# EAGLE design power (EAGLE 6.3)
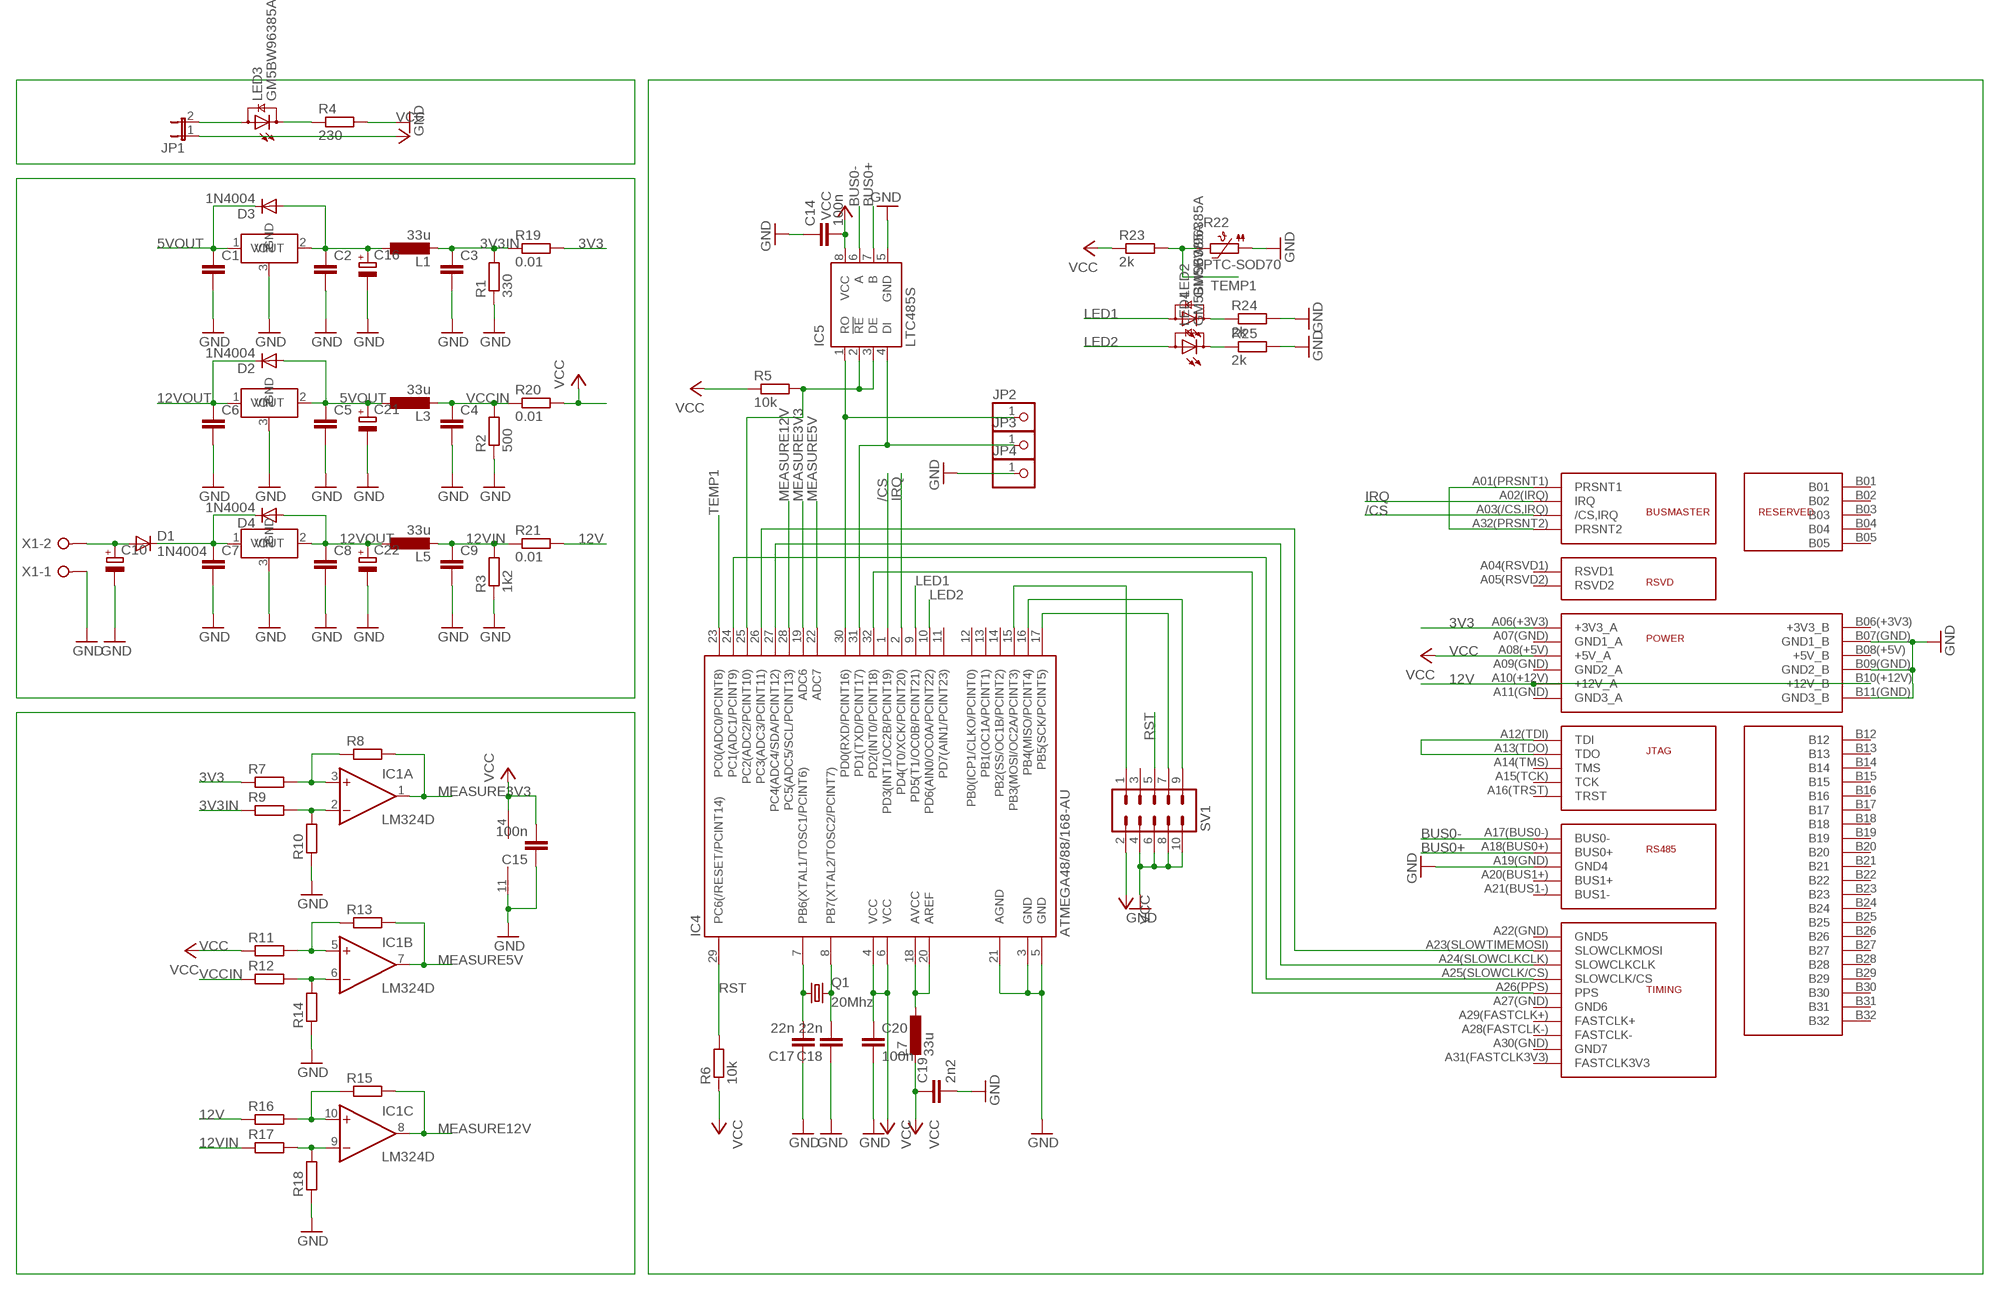
[diagram p0: schematic, sheet 1]

## Parts
C1  C-EUC0805  [C0805]
C2  C-EUC0805  [C0805]
C3  C-EUC0805  [C0805]
C4  C-EUC0805  [C0805]
C5  C-EUC0805  [C0805]
C6  C-EUC0805  [C0805]
C7  C-EUC0805  [C0805]
C8  C-EUC0805  [C0805]
C9  C-EUC0805  [C0805]
C10  CPOL-EU150CLZ-1010  [150CLZ-1010]
C14  100n  C-EUC0603  [C0603]
C15  100n  C-EUC0603  [C0603]
C16  CPOL-EU153CLV-0505  [153CLV-0505]
C17  22n  C-EUC0603  [C0603]
C18  22n  C-EUC0603  [C0603]
C19  2n2  C-EUC0603  [C0603]
C20  100n  C-EUC0603  [C0603]
C21  CPOL-EU153CLV-0505  [153CLV-0505]
C22  CPOL-EU153CLV-0505  [153CLV-0505]
D1  1N4004  [DO41-10]
D2  1N4004  [DO41-10]
D3  1N4004  [DO41-10]
D4  1N4004  [DO41-10]
IC1  LM324D  [SO14]
IC4  ATMEGA48/88/168-AU  [TQFP32-08]
IC5  LTC485S  [SOIC8]
JP1  JP1E  [JP1]
JP2  PINHD-1X1  [1X01]
JP3  PINHD-1X1  [1X01]
JP4  PINHD-1X1  [1X01]
L1  33u  L-EU0207/5V  [0207/5V]
L3  33u  L-EU0207/5V  [0207/5V]
L5  33u  L-EU0207/5V  [0207/5V]
L7  33u  L-EU0207/5V  [0207/5V]
LED2  GM5BW96385A  [GM5BW96385A]
LED3  GM5BW96385A  [GM5BW96385A]
LED4  GM5BW96385A  [GM5BW96385A]
Q1  20Mhz  CRYSTALHC49UP  [HC49UP]
R1  330  R-EU_R0805  [R0805]
R2  500  R-EU_R0603  [R0603]
R3  1k2  R-EU_R0603  [R0603]
R4  230  R-EU_R0603  [R0603]
R5  10k  R-EU_R0603  [R0603]
R6  10k  R-EU_R0603  [R0603]
R7  R-EU_R0603  [R0603]
R8  R-EU_R0603  [R0603]
R9  R-EU_R0603  [R0603]
R10  R-EU_R0603  [R0603]
R11  R-EU_R0603  [R0603]
R12  R-EU_R0603  [R0603]
R13  R-EU_R0603  [R0603]
R14  R-EU_R0603  [R0603]
R15  R-EU_R0603  [R0603]
R16  R-EU_R0603  [R0603]
R17  R-EU_R0603  [R0603]
R18  R-EU_R0603  [R0603]
R19  0.01  R-EU_0207/15  [0207/15]
R20  0.01  R-EU_0207/15  [0207/15]
R21  0.01  R-EU_0207/15  [0207/15]
R22  PTC-SOD70  [SOD70]
R23  2k  R-EU_R0603  [R0603]
R24  2k  R-EU_R0603  [R0603]
R25  2k  R-EU_R0603  [R0603]
SV1  MA05-2  [MA05-2]
U$1  FRIENDSHIPCONNECTOR  [FRIENDSHIP_EDGE_CONNECTOR]
U$2  AP1084  [TO263]
U$3  AP1084  [TO263]
U$4  AP1084  [TO263]
X1  W237-02P  [W237-132]

## Nets
3V3: R7.1 R19.2 U$1.A06(+3V3)(+3V3_A)
3V3IN: C3.1 L1.2 R1.2 R9.1 R19.1
5VOUT: C1.1 C5.1 C21.+ D2.A D3.C L3.1 U$2.1(VIN) U$3.2(VOUT)
12V: R16.1 R21.2 U$1.A10(+12V)(+12V_A) U$1.B10(+12V)(+12V_B)
12VIN: C9.1 L5.2 R3.2 R17.1 R21.1
12VOUT: C6.1 C8.1 C22.+ D2.C D4.A L5.1 U$3.1(VIN) U$4.2(VOUT)
/CS: IC4.1(PD3(INT1/OC2B/PCINT19)) U$1.A03(/CS,IRQ)(/CS,IRQ)
BUS0+: IC5.7(B) U$1.A18(BUS0+)(BUS0+)
BUS0-: IC5.6(A) U$1.A17(BUS0-)(BUS0-)
GND: C1.2 C2.2 C3.2 C4.2 C5.2 C6.2 C7.2 C8.2 C9.2 C10.- C14.1 C15.1 C16.- C17.1 C18.1 C19.2 C20.2 C21.- C22.- IC1.11(P:V-) IC4.3(GND) IC4.5(GND) IC4.21(AGND) IC5.5(GND) JP4.1 R1.1 R2.1 R3.1 R4.2 R10.1 R14.1 R18.1 R22.1 R24.2 R25.2 SV1.4 SV1.6 SV1.8 SV1.10 U$1.A19(GND)(GND4) U$1.B07(GND)(GND1_B) U$1.B09(GND)(GND2_B) U$1.B11(GND)(GND3_B) U$2.3(GND) U$3.3(GND) U$4.3(GND) X1.1
IRQ: IC4.2(PD4(T0/XCK/PCINT20)) U$1.A02(IRQ)(IRQ)
LED1: IC4.9(PD5(T1/OC0B/PCINT21)) LED2.A
LED2: IC4.10(PD6(AIN0/OC0A/PCINT22)) LED4.A
MEASURE3V3: IC1.1(A:OUT) IC4.19(ADC6) R8.2
MEASURE5V: IC1.7(B:OUT) IC4.22(ADC7) R13.2
MEASURE12V: IC1.8(C:OUT) IC4.28(PC5(ADC5/SCL/PCINT13)) R15.2
N$2: C18.2 IC4.8(PB7(XTAL2/TOSC2/PCINT7)) Q1.2
N$5: C2.1 C16.+ D3.A L1.1 U$2.2(VOUT)
N$6: IC4.24(PC1(ADC1/PCINT9)) U$1.A25(SLOWCLK/CS)(SLOWCLK/CS)
N$7: IC1.2(A:-IN) R9.2 R10.2
N$8: IC1.3(A:+IN) R7.2 R8.1
N$9: JP1.2 LED3.A
N$11: C7.1 D1.C D4.C U$4.1(VIN)
N$12: C10.+ D1.A X1.2
N$13: C17.2 IC4.7(PB6(XTAL1/TOSC1/PCINT6)) Q1.1
N$14: IC1.6(B:-IN) R12.2 R14.2
N$15: IC4.18(AVCC) IC4.20(AREF) L7.1
N$16: IC4.16(PB4(MISO/PCINT4)) SV1.9
N$17: IC4.17(PB5(SCK/PCINT5)) SV1.7
N$18: IC4.15(PB3(MOSI/OC2A/PCINT3)) SV1.1
N$19: LED3.C R4.1
N$20: IC4.32(PD2(INT0/PCINT18)) U$1.A26(PPS)(PPS)
N$21: IC4.31(PD1(TXD/PCINT17)) IC5.4(DI) JP3.1
N$22: IC1.5(B:+IN) R11.2 R13.1
N$23: U$1.A01(PRSNT1)(PRSNT1) U$1.A32(PRSNT2)(PRSNT2)
N$24: IC4.27(PC4(ADC4/SDA/PCINT12)) U$1.A24(SLOWCLKCLK)(SLOWCLKCLK)
N$25: IC4.26(PC3(ADC3/PCINT11)) U$1.A23(SLOWTIMEMOSI)(SLOWCLKMOSI)
N$26: IC1.10(C:+IN) R15.1 R16.2
N$28: IC1.9(C:-IN) R17.2 R18.2
N$29: U$1.A12(TDI)(TDI) U$1.A13(TDO)(TDO)
N$30: IC4.30(PD0(RXD/PCINT16)) IC5.1(RO) JP2.1
N$32: IC4.25(PC2(ADC2/PCINT10)) IC5.2(!RE) IC5.3(DE) R5.2
N$36: LED2.C R24.1
N$37: LED4.C R25.1
RST: IC4.29(PC6(/RESET/PCINT14)) R6.2 SV1.5
TEMP1: IC4.23(PC0(ADC0/PCINT8)) R22.2 R23.2
VCC: C14.2 C15.2 C19.1 C20.1 IC1.4(P:V+) IC4.4(VCC) IC4.6(VCC) IC5.8(VCC) JP1.1 L7.2 R5.1 R6.1 R11.1 R20.2 R23.1 SV1.2 U$1.A08(+5V)(+5V_A)
VCCIN: C4.1 L3.2 R2.2 R12.1 R20.1
Unconnected: IC1.12(D:+IN) IC1.13(D:-IN) IC1.14(D:OUT) IC4.11(PD7(AIN1/PCINT23)) IC4.12(PB0(ICP1/CLKO/PCINT0)) IC4.13(PB1(OC1A/PCINT1)) IC4.14(PB2(SS/OC1B/PCINT2)) SV1.3 U$1.A04(RSVD1)(RSVD1) U$1.A05(RSVD2)(RSVD2) U$1.A07(GND)(GND1_A) U$1.A09(GND)(GND2_A) U$1.A11(GND)(GND3_A) U$1.A14(TMS)(TMS) U$1.A15(TCK)(TCK) U$1.A16(TRST)(TRST) U$1.A20(BUS1+)(BUS1+) U$1.A21(BUS1-)(BUS1-) U$1.A22(GND)(GND5) U$1.A27(GND)(GND6) U$1.A28(FASTCLK-)(FASTCLK-) U$1.A29(FASTCLK+)(FASTCLK+) U$1.A30(GND)(GND7) U$1.A31(FASTCLK3V3)(FASTCLK3V3) U$1.B01 U$1.B02 U$1.B03 U$1.B04 U$1.B05 U$1.B06(+3V3)(+3V3_B) U$1.B08(+5V)(+5V_B) U$1.B12 U$1.B13 U$1.B14 U$1.B15 U$1.B16 U$1.B17 U$1.B18 U$1.B19 U$1.B20 U$1.B21 U$1.B22 U$1.B23 U$1.B24 U$1.B25 U$1.B26 U$1.B27 U$1.B28 U$1.B29 U$1.B30 U$1.B31 U$1.B32

## Library data of the parts
C1-C9 C14 C15 C17-C20 = rcl:C-EU: CAPACITOR, European symbol
C10 C16 C21 C22 = rcl:CPOL-EU: POLARIZED CAPACITOR, European symbol
D1-D4 = diode:1N4004: DIODE general purpose rectifier, 1 A
IC1 = linear:LM324: OP AMP
IC4 = atmega8:ATMEGA48/88/168
IC5 = linear-technology:LTC485: Low Power RS485 Interface Transceiver Source: http://www.linear.com/pc/downloadDocument.do?navId=H0,C1,C1007,C1017,P2064,D1718; OC_FARNELL: unknown; OC_NEWARK: unknown
JP1 = jumper:JP1E: JUMPER
JP2-JP4 = pinhead:PINHD-1X1: PIN HEADER
L1 L3 L5 = resistor:L-EU: INDUCTOR, European symbol
L7 = rcl:L-EU: INDUCTOR, European symbol
LED2-LED4 = led:GM5BW96385A: High brightness White Color LED 2300 mcd @ IF = 20mA achieved via InGaN Blue LED chip in combination with Yellow Phosphor Source: http://document.sharpsma.com/files/GM5BW96385A.pdf
Q1 = crystal:CRYSTAL: CRYSTAL; OC_FARNELL: unknown; OC_NEWARK: unknown
R1-R5 R7-R21 R23-R25 = rcl:R-EU_: RESISTOR, European symbol
R6 = resistor:R-EU_: RESISTOR, European symbol
R22 = ptc-ntc:PTC-: Positive Temperature Coefficient Resistor (PTC) termistor Philips KTY81-210 - KTY81-252 Source: 153627-da-01-en-Temperatur-Sensor_KTY10-6_Philips.pdf; OC_FARNELL: unknown; OC_NEWARK: unknown
SV1 = con-lstb:MA05-2: PIN HEADER; OC_FARNELL: unknown; OC_NEWARK: unknown
U$1 = hgg:FRIENDSHIP
U$2-U$4 = hgg:AP1084
X1 = con-wago-508:W237-02P: WAGO SREW CLAMP; OC_FARNELL: unknown; OC_NEWARK: unknown

## Board
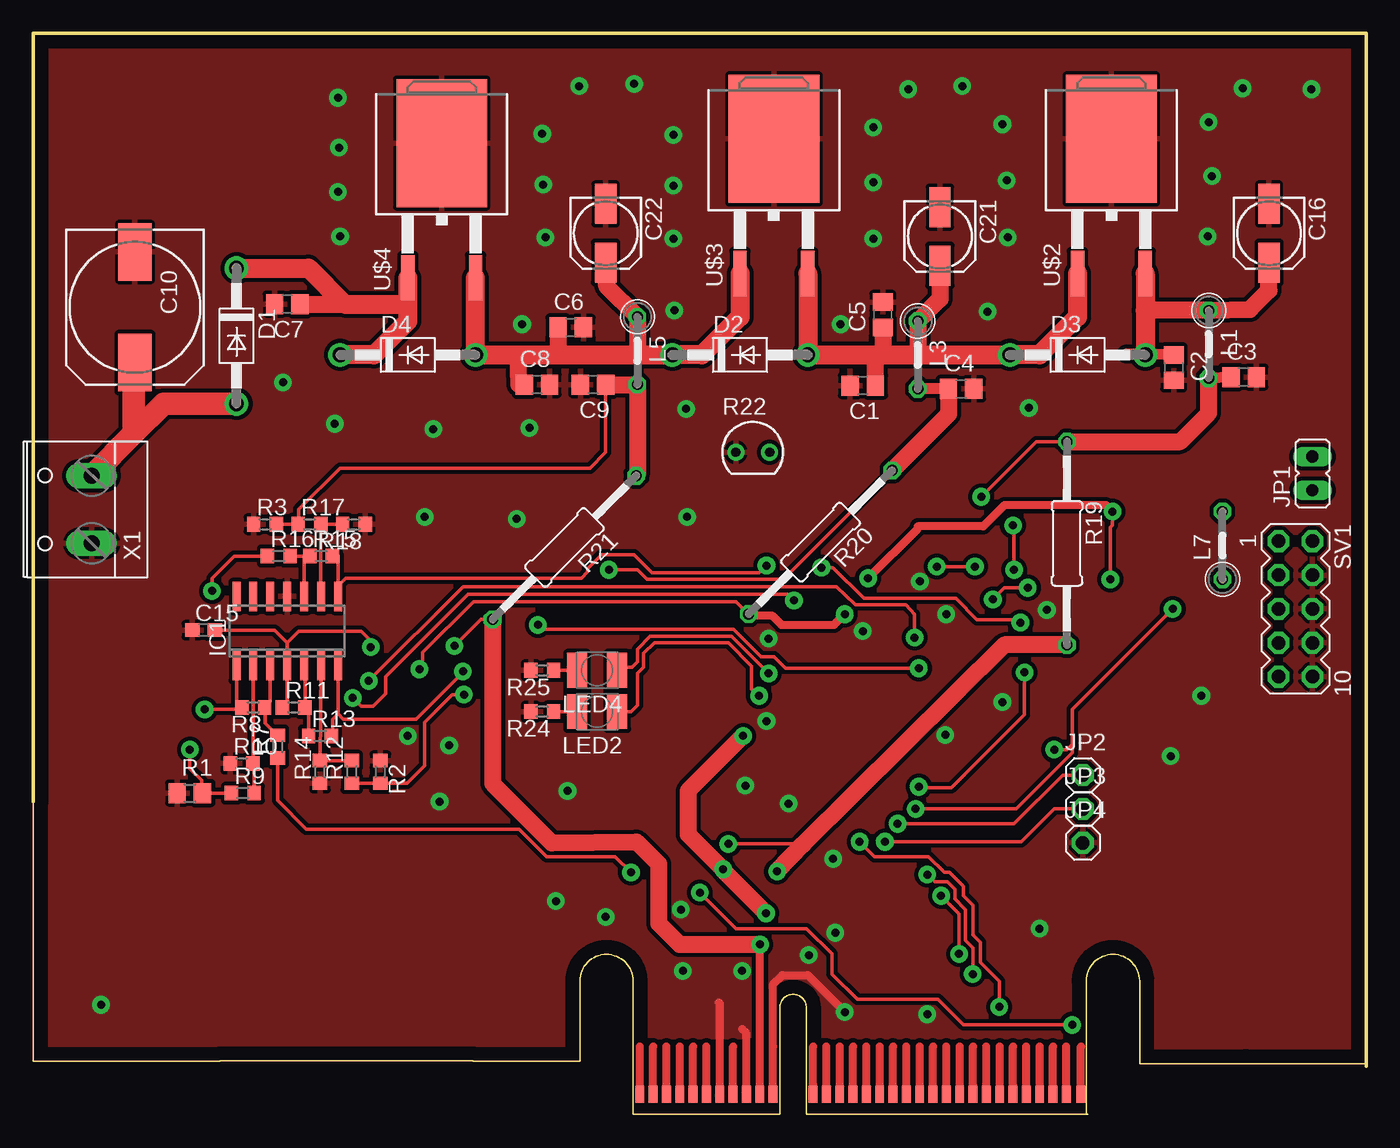
[diagram p1: board, top side]
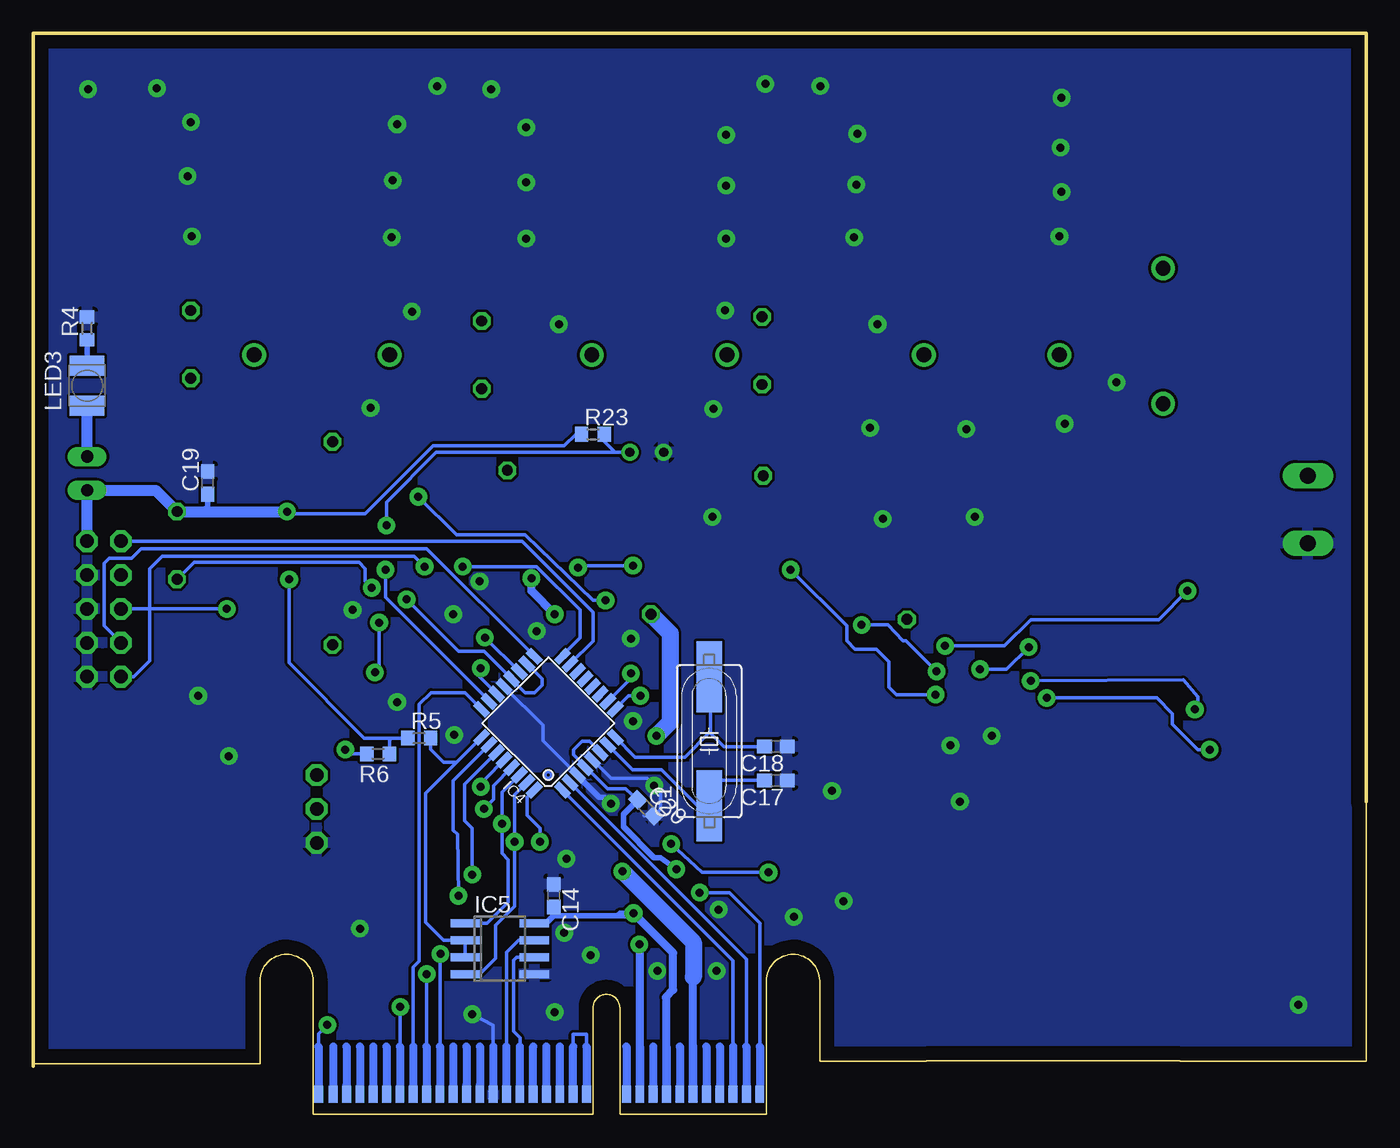
[diagram p2: board, bottom side, seen from below]

Size 100 x 81.08 mm. Coordinates in mm from the lower left corner, seen from the top.
Outline: 100,3.62 100,81.08 0,81.08 0,23.46
Outline: 90.93,3.81 99.97,3.81
Copper layers (1*16): Top 0.035mm / dielectric 1.5mm / Bottom 0.035mm
Design rules "default *": minimum track width 10mil, minimum drill 24mil, track to track 8mil, track to pad 8mil, pad to pad 8mil, via to via 8mil, smd to smd 8mil, copper to edge 40mil, drill to drill 8mil, minimum pad ring 10mil, minimum via ring 8mil, stop-mask expansion 4mil, vias tented up to drill 0mil, thermal gap 10mil

### Footprints (pad centres in the part's own frame; a part is rotated, then mirrored left to right if it is on the bottom)
C0805 = smd 1.3 x 1.5: 1 -0.95,0; 2 0.95,0
150CLZ-1010 = smd 4.3 x 2.5: + 4.15,0; - -4.15,0
C0603 = smd 1.1 x 1: 1 -0.85,0; 2 0.85,0
153CLV-0505 = smd 3 x 1.6: + 2.2,0; - -2.2,0
DO41-10 = drill 1.118: A 5.08,0; C -5.08,0
SO14 = smd 0.6 x 2.2: 1 -3.81,-2.6; 2 -2.54,-2.6; 3 -1.27,-2.6; 4 0,-2.6; 5 1.27,-2.6; 6 2.54,-2.6; 7 3.81,-2.6; 8 3.81,2.6; 9 2.54,2.6; 10 1.27,2.6; 11 0,2.6; 12 -1.27,2.6; 13 -2.54,2.6; 14 -3.81,2.6
TQFP32-08 = smd 1.27 x 0.559: 1 -4.293,2.8; 2 -4.293,2; 3 -4.293,1.2; 4 -4.293,0.4; 5 -4.293,-0.4; 6 -4.293,-1.2; 7 -4.293,-2; 8 -4.293,-2.8; 17 4.293,-2.8; 18 4.293,-2; 19 4.293,-1.2; 20 4.293,-0.4; 21 4.293,0.4; 22 4.293,1.2; 23 4.293,2; 24 4.293,2.8 | smd 0.559 x 1.27: 9 -2.8,-4.293; 10 -2,-4.293; 11 -1.2,-4.293; 12 -0.4,-4.293; 13 0.4,-4.293; 14 1.2,-4.293; 15 2,-4.293; 16 2.8,-4.293; 25 2.8,4.293; 26 2,4.293; 27 1.2,4.293; 28 0.4,4.293; 29 -0.4,4.293; 30 -1.2,4.293; 31 -2,4.293; 32 -2.8,4.293
SOIC8 = smd 0.6 x 2.2: 1 -1.905,-2.6; 2 -0.635,-2.6; 3 0.635,-2.6; 4 1.905,-2.6; 5 1.905,2.6; 6 0.635,2.6; 7 -0.635,2.6; 8 -1.905,2.6
JP1 = drill 0.914 long: 1 0,-1.27; 2 0,1.27
1X01 = drill 1.016 octagon: 1 0,0
0207/5V = drill 0.813 octagon: 1 -2.54,0; 2 2.54,0
GM5BW96385A = smd 1.5 x 2.6: A -1.5,0; C 1.5,0
HC49UP = smd 5.334 x 1.93: 1 -4.826,0; 2 4.826,0
R0805 = smd 1.3 x 1.5: 1 -0.95,0; 2 0.95,0
R0603 = smd 1 x 1.1: 1 -0.85,0; 2 0.85,0
0207/15 = drill 0.813 octagon: 1 -7.62,0; 2 7.62,0
SOD70 = drill 0.7 pad 1.27: 1 -1.27,0; 2 1.27,0
MA05-2 = drill 1.016 octagon: 1 -5.08,-1.27; 2 -5.08,1.27; 3 -2.54,-1.27; 4 -2.54,1.27; 5 0,-1.27; 6 0,1.27; 7 2.54,-1.27; 8 2.54,1.27; 9 5.08,-1.27; 10 5.08,1.27
FRIENDSHIP_EDGE_CONNECTOR = smd 0.66 x 1.27 bottom: A01(PRSNT1) 45.5,-14.5; A02(IRQ) 46.5,-14.5; A03(/CS,IRQ) 47.5,-14.5; A04(RSVD1) 48.5,-14.5; A05(RSVD2) 49.5,-14.5; A06(+3V3) 50.5,-14.5; A07(GND) 51.5,-14.5; A08(+5V) 52.5,-14.5; A09(GND) 53.5,-14.5; A10(+12V) 54.5,-14.5; A11(GND) 55.5,-14.5; A12(TDI) 58.5,-14.5; A13(TDO) 59.5,-14.5; A14(TMS) 60.5,-14.5; A15(TCK) 61.5,-14.5; A16(TRST) 62.5,-14.5; A17(BUS0-) 63.5,-14.5; A18(BUS0+) 64.5,-14.5; A19(GND) 65.5,-14.5; A20(BUS1+) 66.5,-14.5; A21(BUS1-) 67.5,-14.5; A22(GND) 68.5,-14.5; A23(SLOWTIMEMOSI) 69.5,-14.5; A24(SLOWCLKCLK) 70.5,-14.5; A25(SLOWCLK/CS) 71.5,-14.5; A26(PPS) 72.5,-14.5; A27(GND) 73.5,-14.5; A28(FASTCLK-) 74.5,-14.5; A29(FASTCLK+) 75.5,-14.5; A30(GND) 76.5,-14.5; A31(FASTCLK3V3) 77.5,-14.5; A32(PRSNT2) 78.6,-14.5 | smd 0.66 x 1.27: B01 45.5,-14.5; B02 46.5,-14.5; B03 47.5,-14.5; B04 48.5,-14.5; B05 49.5,-14.5; B06(+3V3) 50.5,-14.5; B07(GND) 51.5,-14.5; B08(+5V) 52.5,-14.5; B09(GND) 53.5,-14.5; B10(+12V) 54.5,-14.5; B11(GND) 55.5,-14.5; B12 58.5,-14.5; B13 59.5,-14.5; B14 60.5,-14.5; B15 61.5,-14.5; B16 62.5,-14.5; B17 63.5,-14.5; B18 64.5,-14.5; B19 65.5,-14.5; B20 66.5,-14.5; B21 67.5,-14.5; B22 68.5,-14.5; B23 69.5,-14.5; B24 70.5,-14.5; B25 71.5,-14.5; B26 72.5,-14.5; B27 73.5,-14.5; B28 74.5,-14.5; B29 75.5,-14.5; B30 76.5,-14.5; B31 77.5,-14.5; B32 78.6,-14.5
TO263 = smd 1 x 3.4: 1 -2.54,-6.6; 2 2.54,-6.6 | smd 6.8 x 9.6: 3 0,3.5
W237-132 = drill 1.194 long: 1 -2.54,-0.635; 2 2.54,-0.635

### Placement (x,y rotation side)
C1  62.23,54.66 180 top
C2  85.57,56.01 270 top
C3  90.81,55.29 0 top
C4  69.61,54.42 0 top
C5  63.74,59.97 90 top
C6  40.32,59.02 0 top
C7  19.05,60.77 180 top
C8  37.78,54.73 0 top
C9  41.99,54.73 180 top
C10  7.62,60.53 270 top
C14  60.96,16.4 270 bottom
C15  12.78,36.32 0 top
C16  92.71,66.09 270 top
C17  44.29,25.05 180 bottom
C18  44.29,27.59 180 bottom
C19  86.92,47.35 90 bottom
C20  54.05,22.98 315 bottom
C21  68.02,65.85 270 top
C22  42.94,66.09 270 top
D1  15.24,58.39 270 top
D2  53.02,56.96 0 top
D3  78.34,56.96 0 top
D4  28.1,56.96 0 top
IC1  19.05,36.24 0 top
IC4  61.36,29.34 135 bottom
IC5  65.01,12.43 270 bottom
JP1  95.96,48.07 0 top
JP2  78.74,25.45 0 top
JP3  78.74,22.91 0 top
JP4  78.74,20.37 0 top
L1  88.19,57.75 270 top
L3  66.36,56.96 270 top
L5  45.32,57.27 270 top
L7  89.22,42.67 90 top
LED2  42.31,30.21 180 top
LED3  95.96,54.66 90 bottom
LED4  42.31,33.3 180 top
Q1  49.29,27.99 90 bottom
R1  11.75,24.1 0 top
R2  26.04,25.68 270 top
R3  17.38,44.26 0 top
R4  95.96,58.94 90 bottom
R5  71.04,28.22 0 bottom
R6  74.14,27.03 180 bottom
R7  18.34,27.59 90 top
R8  16.51,30.53 180 top
R9  15.72,24.1 0 top
R10  15.64,26.32 0 top
R11  19.53,30.53 0 top
R12  23.89,25.68 90 top
R13  21.51,28.38 0 top
R14  21.51,25.68 90 top
R15  21.59,41.88 0 top
R16  18.41,41.88 0 top
R17  20.72,44.26 0 top
R18  24.05,44.26 180 top
R19  77.55,42.83 270 top
R20  59.05,42.91 225 top
R21  39.85,42.51 225 top
R22  53.98,49.66 0 top
R23  58.02,51 0 bottom
R24  38.18,30.21 180 top
R25  38.18,33.3 180 top
SV1  94.69,37.91 270 top
U$1  0,16 0 top
U$2  80.88,69.66 0 top
U$3  55.56,69.66 0 top
U$4  30.64,69.34 0 top
X1  3.73,45.37 90 top

### Tracks (layer width: path | path; a pad name or v marks a point on that pad's centre or on a via)
3V3  (via drill 0.6)
  Top 0.254: R7.1 18.34,23.54 20.48,21.4 36.43,21.4 38.5,19.33 43.66,19.33 v44.85,18.14 | v52.15,20.29 57.7,20.29 57.75,20.24
  Top 1.27: R19.2 72.87,35.21 57.75,20.24 v55.8,18.22
  Bottom 0.254: v44.85,18.14 49.85,18.14 v52.15,20.29
  Bottom 0.6: U$1.A06(+3V3) 50.5,10.27 50.48,10.28
  Bottom 1.27: v55.8,18.22 50.48,12.9 50.48,10.28
3V3IN  (via drill 0.6)
  Top 0.254: R9.1 R1.2 12.62,24.17 12.62,25.05 11.75,25.92 v11.75,27.35 | R19.1 75.25,50.45 v71.12,46.32 | v57.07,38.54 56.59,39.02 32.62,39.02 26.43,32.83 26.43,31.56 25.48,30.6 24.61,30.6 v23.97,31.24
  Top 0.813: C3.1 L1.2
  Top 1.27: R19.1 86.04,50.45 88.19,52.59 L1.2
  Bottom 0.254: v71.12,46.32 68.26,43.46 63.1,43.46 58.02,38.54 v57.07,38.54 | v23.97,31.24 15.72,31.24 14.53,30.05 14.53,29.26 12.62,27.35 v11.75,27.35
5VOUT
  Top 1.27: 66.04,56.96 66.36,57.27 L3.1 68.02,61.16 C21.+ | C5.1 63.74,57.04 63.82,56.96 | C1.1 63.18,56.95 63.18,56.96
  Top 1.422: U$2.1 78.34,59.81 75.49,56.96 D3.C 66.04,56.96 63.82,56.96 63.18,56.96 D2.A U$3.2
12V  (via drill 0.6)
  Top 0.254: R21.2 33.59,37.12 v31.59,35.13 | v13.41,39.26 13.41,40.21 15.08,41.88 R16.1
  Top 0.61: U$1.B10(+12V) 54.5,12.71 v54.53,12.75
  Top 1.27: R21.2 34.46,24.8 38.89,20.37 45.24,20.44 46.91,18.78 46.91,14.33 48.5,12.75 v54.53,12.75
  Bottom 0.254: v31.59,35.13 27.15,35.13 25.16,37.11 15.56,37.11 v13.41,39.26
  Bottom 0.61: U$1.B10(+12V) 54.5,12.27 54.5,12.71 v54.53,12.75
12VIN
  Top 0.254: R3.2 R17.1 19.92,44.31 19.92,45.37 23.02,48.46 41.75,48.46 42.94,49.65 C9.1
  Top 1.27: C9.1 L5.2 45.32,47.99 R21.1
12VOUT
  Top 1.27: 45.32,56.96 L5.1 43.02,62.12 43,64.02 C22.+ | C8.1 36.43,54.73 36.35,56.96 D4.A | C6.1 39.37,56.95 35.96,56.96
  Top 1.422: U$3.1 53.02,59.81 50.16,56.96 D2.C 45.32,56.96 36.35,56.96 35.96,56.96 D4.A U$4.2
/CS
  Bottom 0.254: IC4.1 47.5,11.52 U$1.A03(/CS,IRQ)
BUS0+
  Bottom 0.254: U$1.A18(BUS0+) 64.5,12.14 63.58,13.06 IC5.7
BUS0-
  Bottom 0.254: IC5.6 63.74,11.79 63.98,11.55 63.98,6.24 63.5,5.76 U$1.A17(BUS0-)
GND  (via drill 0.6)
  Top 0.254: v67.07,7.51 67.07,7.75
  Top 0.61: U$1.B07(GND) 51.5,8.31 51.44,8.38 | U$1.B09(GND) 53.5,6.08 53.18,6.4 | U$1.B11(GND) 55.5,9.75 56.2,10.44 58.1,10.44 v60.88,7.67
  Top 1.422: 55.24,72.84 U$3.3
  Bottom 0.254: U$1.A19(GND) 65.5,6.7 v67.07,7.51 | 54.18,22.38 C20.2 52.94,22.89 52.94,24.18 53.98,25.21 56.66,25.21 IC4.5 | IC4.21 64.67,32.09 61.75,29.18 61.75,28.03 IC4.3
  Bottom 0.406: IC4.3 59.17,25.4 57.55,23.78 57.15,23.78 v56.67,23.3
  other vias: 76.04,37.83 5.08,8.22 66.52,39.97 68.5,37.51 48.74,10.76 55.17,35.69 62.23,36.24 30.48,23.46 40.08,24.25 53.42,24.65 55.01,29.49 60.01,19.18 23.02,65.85 22.86,69.18 22.94,72.52 22.86,76.25 40.96,77.12 45.09,77.28 65.64,76.88 69.69,77.12 90.73,76.96 95.89,76.88 74.69,52.99 48.97,52.91 37.23,51.48 30,51.4 22.62,51.8 18.73,54.89 36.67,59.26 48.1,60.29 60.56,59.26 71.6,60.21 29.37,44.81 36.27,44.65 49.05,44.81 87.63,31.4 85.33,26.87 75.49,13.94 42.94,14.81 39.21,16 31.19,27.67 72.71,30.92 68.42,28.46 28.1,28.38 48.58,15.37 53.18,10.76 60.17,13.62 58.18,11.95 38.18,73.55 38.26,69.74 38.42,65.77 48.02,65.69 48.02,69.66 48.02,73.47 63.02,74.02 63.02,69.9 63.02,65.69 73.1,65.77 73.03,70.05 72.71,74.26 88.19,74.42 88.42,70.37 88.11,65.85
  pour Top (isolate 0.305): -2.7,85.37 117,85.37 117,-7.02 -6.03,-7.02 -6.03,85.37
  pour Bottom: -25.64,132.68 128.75,132.68 128.75,-18.53 -25.64,-18.53
IRQ
  Bottom 0.254: IC4.2 46.5,11.65 U$1.A02(IRQ)
LED1  (via drill 0.6)
  Top 0.254: v54.45,31.4 53.9,31.87 53.9,33.62 52.15,35.37 46.59,35.37 45.8,34.57 45.8,33.54 45.32,33.07 45.32,30.68 44.85,30.21 LED2.A
  Bottom 0.254: v54.45,31.4 55.33,31.4 IC4.9
LED2  (via drill 0.6)
  Top 0.254: LED4.A 44.13,33.54 44.93,33.54 45.32,33.94 45.32,34.89 46.28,35.84 52.39,35.84 v55.17,33.07
  Bottom 0.254: IC4.10 55.17,32.7 v55.17,33.07
MEASURE3V3  (via drill 0.6)
  Top 0.254: IC1.1 15.24,30.95 R8.2 15.5,30.37 v12.86,30.37 | v66.12,35.76 66.12,37.51 65.48,38.23 61.67,38.23 60.25,39.57 32.23,39.57 v25.16,32.51
  Bottom 0.254: IC4.19 63.57,33.22 v66.12,35.76 | v25.16,32.51 13.73,32.59 12.62,31.32 12.62,30.6 v12.86,30.37
MEASURE5V  (via drill 0.6)
  Top 0.254: IC1.7 22.86,30.05 | 22.86,30.05 22.46,29.65 22.46,28.41 R13.2 | v66.44,33.46 56.44,33.46 55.56,34.34 54.61,34.34 52.55,36.4 38.18,36.4 v37.86,36.72 | v32.23,33.22 32.23,33.15 28.73,29.65 23.26,29.65 22.86,30.05
  Bottom 0.254: IC4.22 65.24,31.55 66.52,32.83 66.52,33.38 v66.44,33.46 | v37.86,36.72 35.88,36.72 34.77,35.53 34.53,35.53 v32.23,33.22
MEASURE12V  (via drill 0.6)
  Top 0.254: R15.2 22.86,41.93 IC1.8 23,38.84 23.02,38.86 23.02,39.81 23.42,40.21 41.12,40.21 41.59,40.69 41.59,40.92 42.62,41.96 45.09,41.96 46.43,40.61 54.45,40.61 v55.01,41.16 | v66.44,24.57 66.52,24.49 68.9,24.49 74.37,29.97 v74.37,33.15 | v74.06,36.88 73.82,37.11 70.8,37.11 69.22,38.7 62.31,38.7 60.01,41 v59.13,41
  Bottom 0.254: IC4.28 66.12,25.14 v66.44,24.57 | v74.37,33.15 74.06,33.46 v74.06,36.88 | v55.01,41.16 58.98,41.16 v59.13,41
N$2
  Bottom 0.254: IC4.8 54.85,26.8 51.12,26.8 49.25,28.66 | 49.25,28.66 49.21,28.7 49.21,32.73 Q1.2 | C18.2 48.18,27.59 49.25,28.66
N$5
  Top 0.813: C2.1 82,57.03 D3.A
  Top 1.27: 83.42,60.29 L1.1 91.28,60.37 92.71,61.8 C16.+
  Top 1.422: U$2.2 83.42,60.29 D3.A
N$6
  Bottom 0.254: U$1.A25(SLOWCLK/CS) 71.5,11.02 71.04,11.48 71.04,30.76 70.17,31.64 67.62,31.64 IC4.24
N$7
  Top 0.254: IC1.2 16.51,26.34 R10.2 16.57,26.24 R9.2
N$8
  Top 0.254: IC1.3 17.78,30.95 R8.1 17.38,30.5 17.38,29.34 18.28,28.44 R7.2
N$9
  Bottom 0.813: JP1.2 LED3.A
N$11
  Top 1.27: C7.1 23.5,60.77
  Top 1.422: U$4.1 28.1,60.77 | 28.1,60.77 28.1,59.5 25.56,56.96 D4.C | D1.C 20.64,63.47 23.34,60.77 23.5,60.77 28.1,60.77
N$12
  Top 1.676: X1.2 7.54,51.08 | 7.54,51.08 9.76,53.31 D1.A | C10.+ 7.54,55.35 7.54,51.08
N$13
  Bottom 0.254: IC4.7 55.04,25.84 52.86,25.84 50.16,23.14 49.28,23.14 | C17.2 48.74,25.05 49.29,24.49 Q1.1 49.28,23.14 | 49.21,23.14 49.28,23.14
N$14
  Top 0.254: IC1.6 R14.2 R12.2
N$15  (via drill 0.6)
  Top 0.254: v74.61,39.49 72.87,39.49 v71.99,38.62
  Bottom 0.254: IC4.20 | L7.1 87.95,41.4 75.56,41.4 75.09,40.92 75.09,39.97 v74.61,39.49 | v71.99,38.62 68.1,34.73 66.19,34.73 IC4.20 | IC4.20 64.11,32.64 63.1,31.64 62.39,31.64 61.83,32.19 61.83,32.67 62.95,33.78 IC4.18
N$16  (via drill 0.6)
  Top 0.254: v70.64,41.08 v67.79,41.08
  Bottom 0.254: SV1.9 92.47,32.83 91.28,34.02 91.28,40.92 90.33,41.88 71.44,41.88 v70.64,41.08 | v67.79,41.08 62.23,41.08 58.98,37.83 58.98,35.76 60.3,34.44 IC4.16
N$17
  Bottom 0.254: IC4.17 70.49,42.43 91.92,42.43 92.63,41.72 94.3,41.72 94.69,41.32 94.69,36.64 SV1.7
N$18
  Bottom 0.254: SV1.1 63.34,42.99 58.02,37.67 58.02,35.5 IC4.15
N$19
  Bottom 0.406: R4.1 LED3.C
N$20  (via drill 0.6)
  Top 0.254: v72.47,8.06 72.47,9.97 71.04,11.4 71.04,12.9 70.48,13.46 70.48,15.68 69.77,16.4 69.77,17.11 68.74,18.14 68.34,18.14 67.15,19.33 63.1,19.33 v61.99,20.44
  Bottom 0.254: U$1.A26(PPS) 72.5,8.03 v72.47,8.06 | v61.99,20.44 61.99,21.48 62.94,22.43 62.94,23.79 IC4.32
N$21  (via drill 0.6)
  Top 0.254: v63.9,20.44 74.14,20.44 76.6,22.91 JP3.1
  Bottom 0.254: IC5.4 66.52,10.52 65.33,11.71 65.33,14.17 63.9,15.6 v63.9,20.44 63.9,23.97 IC4.31
N$22
  Top 0.254: IC1.5 20.38,33.58 R11.2 20.66,30.24 R13.1
N$23  (via drill 0.6)
  Top 0.254: v77.95,6.71 69.77,6.71 67.87,8.62 61.83,8.62 59.93,10.52 59.93,12.03 58.02,13.94 52.7,13.94 v50.01,16.63
  Bottom 0.254: U$1.A32(PRSNT2) 78.6,6.06 v77.95,6.71 | U$1.A01(PRSNT1) 45.5,14.35 47.78,16.63 v50.01,16.63
N$24  (via drill 0.6)
  Top 0.254: v70.48,10.52 70.48,12.51 69.93,13.06 69.93,15.36 69.14,16.16 69.14,16.87 68.58,17.43 67.63,17.43 v67.07,17.98
  Bottom 0.254: U$1.A24(SLOWCLKCLK) 70.5,10.51 v70.48,10.52 | v67.07,17.98 67.07,21.48 67.63,22.03 67.63,24.76 IC4.27
N$25  (via drill 0.6)
  Top 0.254: v69.45,12.03 69.45,15.05 v68.1,16.4
  Bottom 0.254: U$1.A23(SLOWTIMEMOSI) 69.5,11.98 v69.45,12.03 | v68.1,16.4 68.18,21 68.5,21.32 68.5,25.02 IC4.26
N$26
  Top 0.254: IC1.10 20.32,41.93 R15.1 R16.2
N$28
  Top 0.254: IC1.9 21.57,38.86 R17.2 R18.2
N$29
  Bottom 0.254: U$1.A12(TDI) 58.5,6 59.5,6 U$1.A13(TDO)
N$30  (via drill 0.6)
  Top 0.254: JP2.1 77.23,25.45 73.58,21.79 v64.85,21.79
  Bottom 0.254: IC5.1 65.96,14.33 64.37,15.92 64.37,19.1 64.85,19.57 v64.85,21.79 64.85,24.15 64.37,24.62 | 64.37,24.62 IC4.30 | 64.37,24.62 64.4,24.62
N$32
  Bottom 0.254: IC5.3 IC5.2 69.22,13.06 70.56,14.41 70.56,24.09 68.25,26.4 | IC4.25 67.98,26.67 68.25,26.4 | R5.2 70.19,27.37 69.22,26.4 68.25,26.4
N$36
  Top 0.254: R24.1 LED2.C
N$37
  Top 0.254: R25.1 LED4.C
RST  (via drill 0.6)
  Top 0.254: v66.2,22.91 73.74,22.91 77.95,27.11 77.95,27.75 | 77.95,27.75 77.95,30.37 v85.49,37.91 | v76.6,27.35 77.55,27.35 77.95,27.75
  Bottom 0.254: IC4.29 65.48,24.64 65.48,23.62 v66.2,22.91 | v85.49,37.91 SV1.5 | R6.2 76.28,27.03 v76.6,27.35
TEMP1  (via drill 0.6)
  Top 0.254: v73.58,40.84 73.58,44.1 v73.5,44.18
  Bottom 0.254: IC4.23 65.81,31.01 73.58,38.78 v73.58,40.84 | v73.5,44.18 73.5,45.92 69.77,49.66 56.36,49.66 | 56.36,49.66 R22.2 | R23.2 57.17,50.47 56.36,49.66
VCC  (via drill 0.6)
  Top 0.254: v80.8,40.13 80.8,44.02 80.96,44.18 v80.96,45.21 | R11.1 19.05,30.98 IC1.4 19.05,35.37 | 19.05,35.37 18.1,36.32 C15.2 | R20.2 52.72,38.46 33.02,38.46 29.21,34.65 29.21,33.62 v28.97,33.38 | v25.32,35.05 25.32,35.53 24.61,36.24 19.92,36.24 19.05,35.37
  Top 0.406: v51.75,18.38 51.91,18.14
  Top 0.61: v80.96,45.21 80.49,45.69 72.87,45.69 71.28,44.1 66.36,44.1 66.36,43.94 v62.63,40.21 | R20.2 53.76,37.43 55.4,37.43 56.12,36.72 60.09,36.72 v60.88,37.51
  Top 1.27: 51.91,18.14 v54.97,15.09 | v53.26,28.38 49.13,24.25 49.13,21 v51.75,18.38
  Bottom 0.254: R5.1 73.1,28.22 | 73.1,28.22 75.17,28.22 80.8,33.86 v80.8,40.13 | 80.8,45.05 v80.96,45.21 | R6.1 73.29,28.04 73.1,28.22 | R23.1 59.29,51 60.17,50.13 70.01,50.13 75.09,45.05 81.2,45.05 81.36,45.21 | C20.1 55.56,24.41 56.91,24.41 58.52,26.02 IC4.4 58.6,26.11 59.45,26.95 59.45,27.35 58.82,27.99 58.26,27.99 57.47,27.2 IC4.6 | v28.97,33.38 26.99,33.38 v25.32,35.05
  Bottom 0.406: IC5.8 61.52,14.33 60.96,14.89 | 60.96,14.89 C14.2 | C19.1 86.92,45.37 87.07,45.21 | 60.96,14.89 56.2,14.89 | 56.2,14.89 55.01,14.89 54.89,15.01 | C20.1 54.66,23.57 55.72,22.51 55.72,21.56 53.42,19.25 52.94,19.25 v51.75,18.38 | v54.97,15.09 56,15.09 56.2,14.89
  Bottom 0.61: 55.17,15.29 v54.97,15.09 54.89,15.01 51.99,12.11 51.99,9.33 52.55,8.78 52.5,8.73 U$1.A08(+5V) | v62.63,40.21 62.63,39.26 v60.88,37.51
  Bottom 0.813: SV1.2 JP1.1 90.81,46.8 L7.2 87.07,45.21 81.36,45.21 v80.96,45.21
  Bottom 1.27: R20.2 52.23,36.08 52.23,29.41 v53.26,28.38
VCCIN  (via drill 0.6)
  Top 0.254: R12.1 R2.2 28.04,24.83 29.37,26.16 29.37,29.41 31.43,31.48 v32.31,31.48 | v43.18,40.84 45.32,40.84 46.04,40.13 56.28,40.13 R20.1
  Top 0.813: C4.1 L3.2
  Top 1.27: C4.1 68.66,52.52 R20.1
  Bottom 0.254: v32.31,31.48 35.24,31.48 35.8,32.03 35.8,33.94 36.75,34.89 38.34,34.89 38.97,35.53 38.97,36.64 v43.18,40.84
(copper drawn outside any net)
  shapes: Bottom circle x1